# EAGLE schematic Spannungssenke (EAGLE 8.3.2)
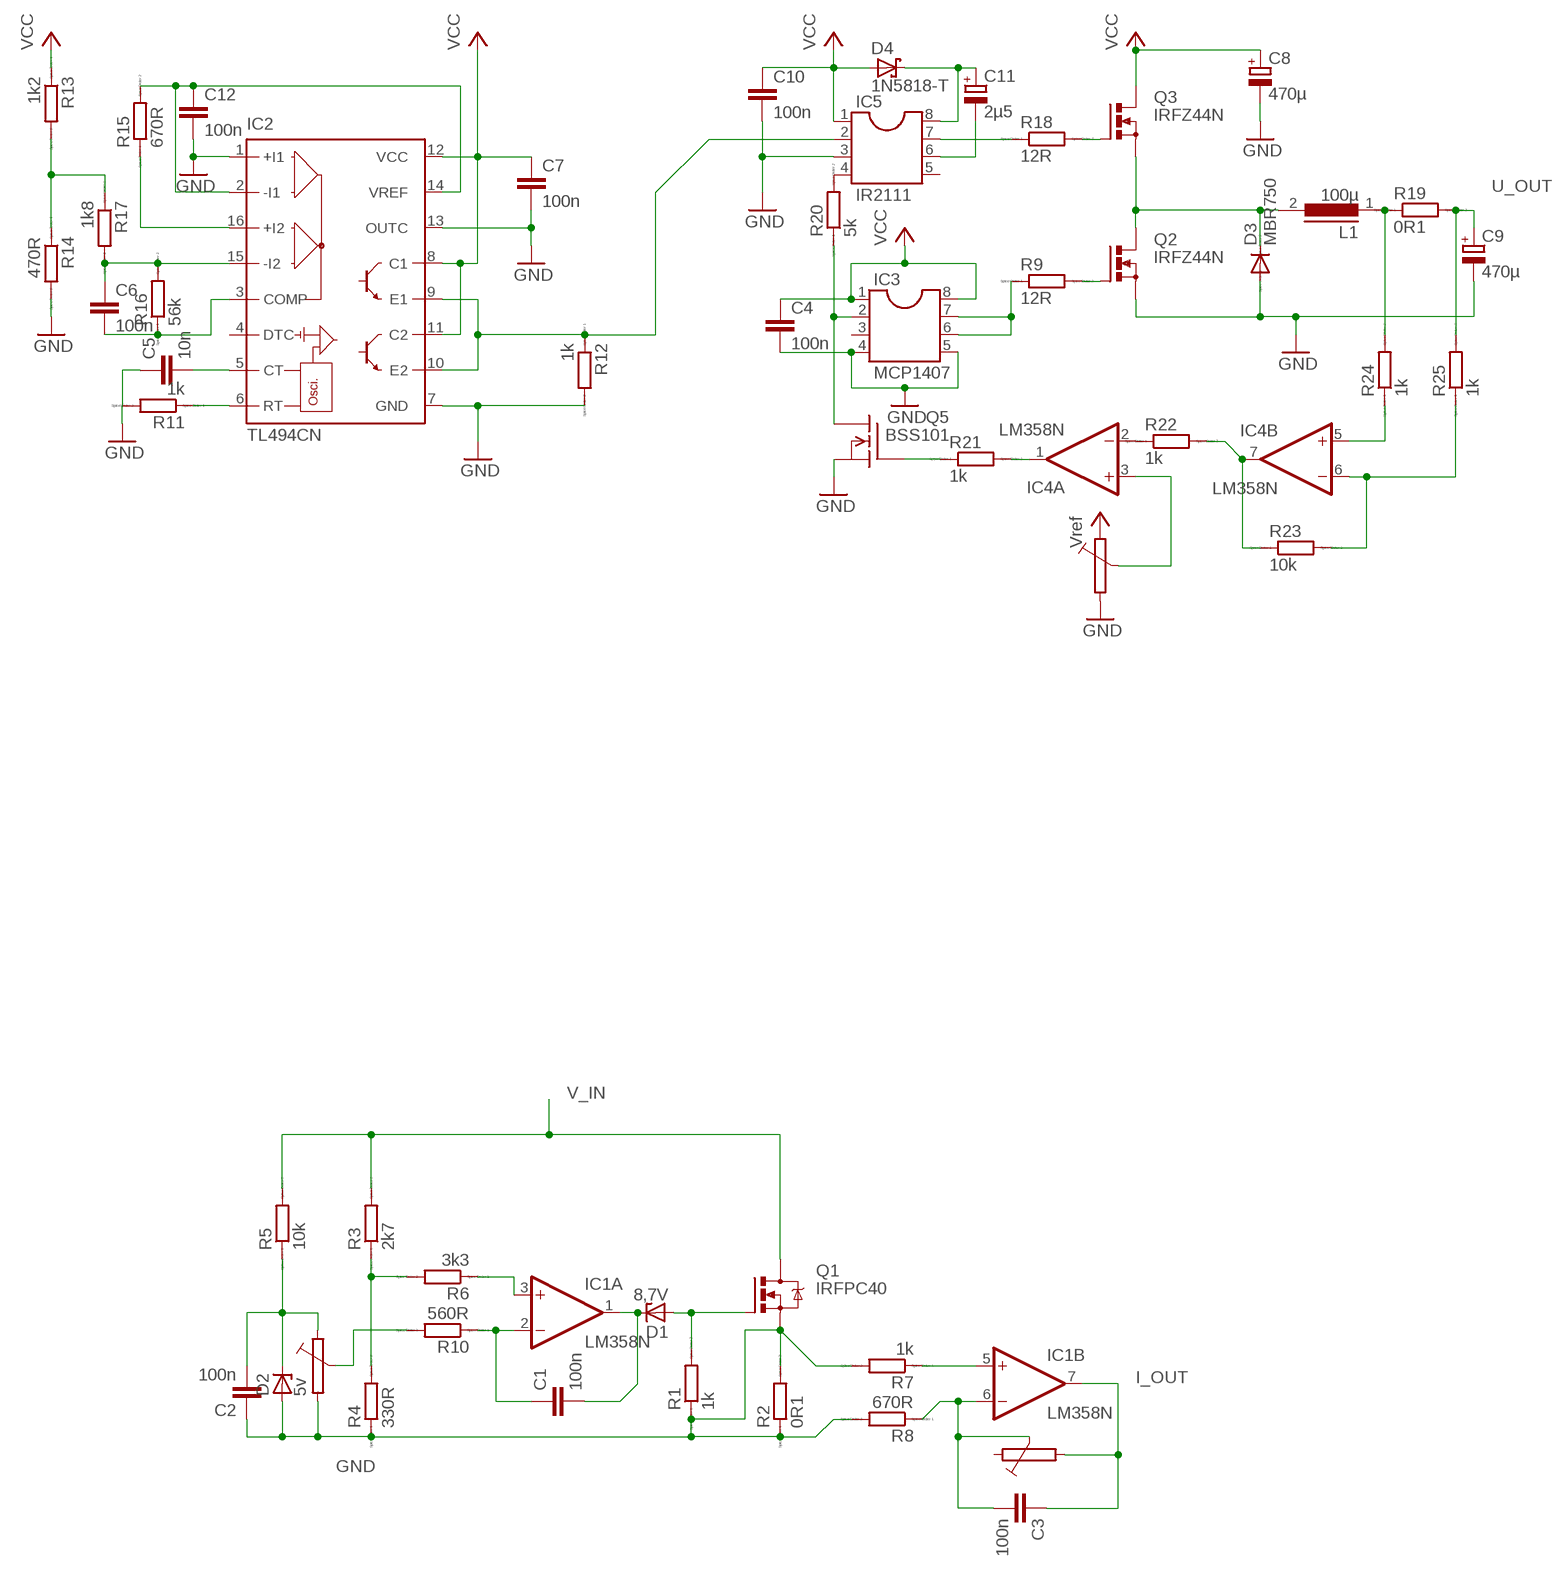
[diagram p0: schematic, sheet 1]

## Parts
C1  100n  C5/2.5  [C5B2.5]
C2  100n  C5/2.5  [C5B2.5]
C3  100n  C5/2.5  [C5B2.5]
C4  100n  C5/2.5  [C5B2.5]
C5  10n  C5/2.5  [C5B2.5]
C6  100n  C5/2.5  [C5B2.5]
C7  100n  C5/2.5  [C5B2.5]
C8  470µ  CPOL-EUE3.5-10  [E3,5-10]
C9  470µ  CPOL-EUE3.5-10  [E3,5-10]
C10  100n  C5/2.5  [C5B2.5]
C11  2µ5  CPOL-EUE2.5-5  [E2,5-5]
C12  100n  C5/2.5  [C5B2.5]
D1  8,7V  ZENER-DIODEC1702-15  [C1702-15]
D2  5v  ZENER-DIODEC1702-15  [C1702-15]
D3  MBR750  [TO220AC]
D4  1N5818-T  [DO41-7.6]
IC1  LM358N  [DIL08]
IC2  TL494CN  [DIL16]
IC3  MCP1407  DIL8  [DIL08]
IC4  LM358N  [DIL08]
IC5  IR2111  DIL8  [DIL08]
L1  100µ  ED38  [ED38]
Q1  IRFPC40  [TO247BV]
Q2  IRFZ44N  PMOSFET_NTO220BV  [TO220BV]
Q3  IRFZ44N  PMOSFET_NTO220BV  [TO220BV]
Q5  BSS101  [TO92]
R1  1k  R0207/10  [0207/10]
R2  0R1  R0207/10  [0207/10]
R3  2k7  R0207/10  [0207/10]
R4  330R  R0207/10  [0207/10]
R5  10k  R0207/10  [0207/10]
R6  3k3  R0207/10  [0207/10]
R7  1k  R0207/10  [0207/10]
R8  670R  R0207/10  [0207/10]
R9  12R  R0207/10  [0207/10]
R10  560R  R0207/10  [0207/10]
R11  1k  R0207/10  [0207/10]
R12  1k  R0207/10  [0207/10]
R13  1k2  R0207/10  [0207/10]
R14  470R  R0207/10  [0207/10]
R15  670R  R0207/10  [0207/10]
R16  56k  R0207/10  [0207/10]
R17  1k8  R0207/10  [0207/10]
R18  12R  R0207/10  [0207/10]
R19  0R1  R0207/10  [0207/10]
R20  5k  R0207/10  [0207/10]
R21  1k  R0207/10  [0207/10]
R22  1k  R0207/10  [0207/10]
R23  10k  R0207/10  [0207/10]
R24  1k  R0207/10  [0207/10]
R25  1k  R0207/10  [0207/10]

## Nets
GND: C2.1 C4.2 C7.2 C8.- C9.- C10.2 C12.2 D2.A D3.A IC2.1(+I1) IC2.7(GND) IC2.13(OUTC) IC3.4 IC3.5 IC5.3 Q1.S Q2.S Q5.1(S) R1.1 R2.1 R2.2 R4.1 R7.2 R8.2 R12.2 R14.2
I_OUT: C3.1 IC1.7(B:OUT)
N$1: D1.A Q1.G R1.2
N$2: IC1.3(A:+IN) R6.1
N$3: IC2.16(+I2) R15.1
N$4: C2.2 D2.C R5.1
N$5: IC2.6(RT) R11.1
N$6: C1.2 D1.C IC1.1(A:OUT)
N$7: IC1.5(B:+IN) R7.1
N$8: R3.1 R4.2 R6.2
N$9: C1.1 IC1.2(A:-IN) R10.1
N$10: C3.2 IC1.6(B:-IN) R8.1
N$11: R10.2
N$12: C5.2 IC2.5(CT)
N$13: C5.1 R11.2
N$14: IC2.9(E1) IC2.10(E2) IC5.2 R12.1
N$15: C6.2 IC2.3(COMP) R16.1
N$16: C6.1 IC2.15(-I2) R16.2 R17.2
N$17: R13.2 R14.1 R17.1
N$18: C12.1 IC2.2(-I1) IC2.14(VREF) R15.2
N$19: C11.- IC5.6
N$20: C11.+ D4.C IC5.8
N$21: IC5.7 R18.1
N$22: Q2.G R9.2
N$23: D3.C L1.2 Q2.D Q3.S
N$24: Q3.G R18.2
N$25: L1.1 R19.1 R24.2
N$26: IC3.6 IC3.7 R9.1
N$27: IC5.4 R20.2
N$28: IC3.2 Q5.3(D) R20.1
N$29: IC4.2(A:-IN) R22.1
N$30: IC4.5(B:+IN) R24.1
N$31: IC4.1(A:OUT) R21.2
N$32: Q5.2(G) R21.1
N$33: IC4.6(B:-IN) R23.2 R25.1
N$34: IC4.7(B:OUT) R22.2 R23.1
N$36: IC4.3(A:+IN)
U_OUT: C9.+ R19.2 R25.2
V_IN: Q1.D R3.2 R5.2
VCC: C4.1 C7.1 C8.+ C10.1 D4.A IC2.8(C1) IC2.11(C2) IC2.12(VCC) IC3.1 IC3.8 IC5.1 Q3.D R13.1
Unconnected: IC2.4(DTC) IC3.3 IC5.5

## Power pins joined to a net without a drawn wire
V+: IC1.8(P:V+) IC4.8(P:V+)
V-: IC1.4(P:V-) IC4.4(P:V-)

## Library data of the parts
C1-C7 C10 C12 = capacitor-wima:C: CAPACITOR naming: grid - package width
C8 C9 C11 = resistor:CPOL-EU: POLARIZED CAPACITOR, European symbol
D1 D2 = diode:ZENER-DIODE: Z-Diode
D3 = diode:MBR750: DIODE barrier rectifier, 7.5 A, 50 V
D4 = diode:1N581*: 1.0A SCHOTTKY BARRIER RECTIFIER Source: http://www.diodes.com/datasheets/ds23001.pdf
IC1 IC4 = linear:LM358: OP AMP also LM158; LM258; LM2904 Source: http://cache.national.com/ds/LM/LM158.pdf
IC2 = linear:TL494*: SWITCHMODE Pulse Width Modulation Control Circuit NCV494B http://onsemi.com tl494-d.pdf
IC3 IC5 = ic-package:DIL8: Dual In Line / Socket
L1 = inductors:ED38: INDUCTOR
Q1 = transistor-power:IRFPC40: N-CHANNEL MOS FET
Q2 Q3 = transistor-power:PMOSFET_N: Power MOSFET N-Channel
Q5 = transistor-fet:BSS101: N-Channel Enhancement MOSFET 200V; 0,16A; 11Ohm
R1-R25 = eagle-ltspice:R: RESISTOR, European symbol; SPICEMODEL: NONE; SPICEPREFIX: R